# Altium project Elkapod_power_supply_controller_module.PrjPcb (part 5 of 5)
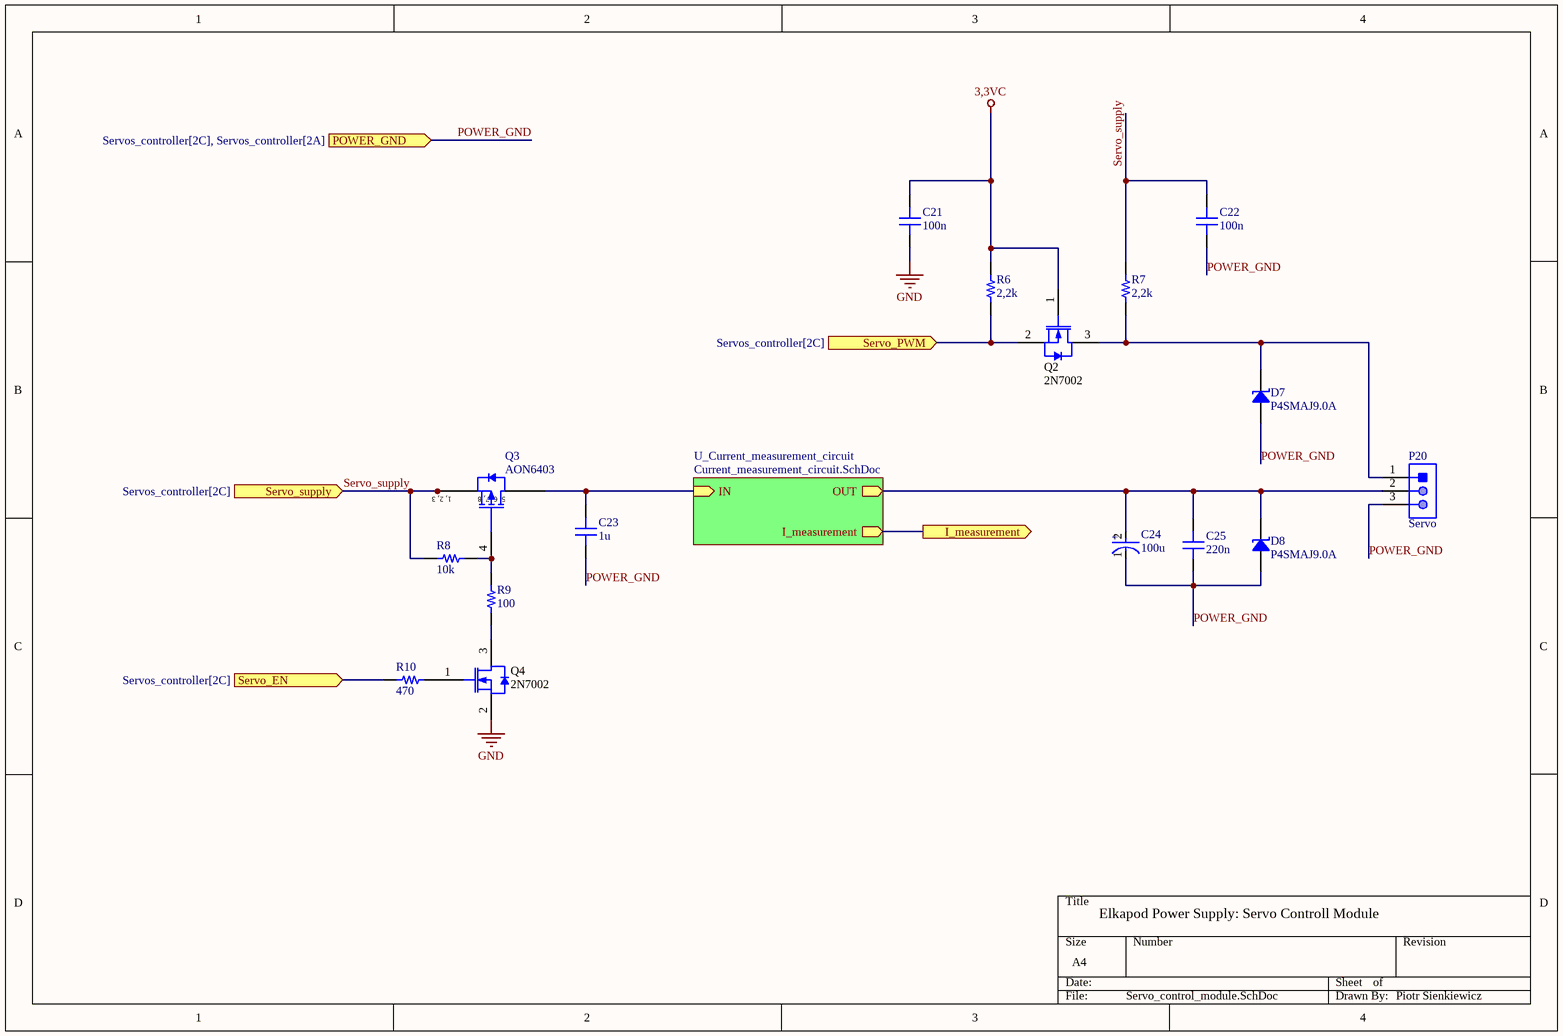
[diagram p9: Servo_control_module.SchDoc]

## Nets that join several sheets (continued)
SCK: Elkapod_power_supply_controller_module (CN1.20), Logic_controller (U3.111)
SCL: Elkapod_power_supply_controller_module (CN1.26), Logic_controller (R32.2 U3.11)
SDA: Elkapod_power_supply_controller_module (CN1.25), Logic_controller (R31.2 U3.10)
SERVO1_EN: Logic_controller (U3.69), U_Servos_controller/U_Servo_control_module (R10_U_Servos_controller_U_Servo_control_module#7.1)
SERVO2_EN: Logic_controller (U3.68), U_Servos_controller/U_Servo_control_module (R10_U_Servos_controller_U_Servo_control_module#8.1)
SERVO3_EN: Logic_controller (U3.67), U_Servos_controller/U_Servo_control_module (R10_U_Servos_controller_U_Servo_control_module#9.1)
SERVO4_EN: Logic_controller (U3.66), U_Servos_controller/U_Servo_control_module (R10_U_Servos_controller_U_Servo_control_module#10.1)
SERVO5_EN: Logic_controller (U3.65), U_Servos_controller/U_Servo_control_module (R10_U_Servos_controller_U_Servo_control_module#11.1)
SERVO6_EN: Logic_controller (U3.64), U_Servos_controller/U_Servo_control_module (R10_U_Servos_controller_U_Servo_control_module#12.1)
SERVO7_EN: Logic_controller (U3.63), U_Servos_controller/U_Servo_control_module (R10_U_Servos_controller_U_Servo_control_module#13.1)
SERVO8_EN: Logic_controller (U3.60), U_Servos_controller/U_Servo_control_module (R10_U_Servos_controller_U_Servo_control_module#14.1)
SERVO9_EN: Logic_controller (U3.59), U_Servos_controller/U_Servo_control_module (R10_U_Servos_controller_U_Servo_control_module#15.1)
SERVO10_EN: Logic_controller (U3.58), U_Servos_controller/U_Servo_control_module (R10_U_Servos_controller_U_Servo_control_module#16.1)
SERVO11_EN: Logic_controller (U3.57), U_Servos_controller/U_Servo_control_module (R10_U_Servos_controller_U_Servo_control_module#17.1)
SERVO12_EN: Logic_controller (U3.56), U_Servos_controller/U_Servo_control_module (R10_U_Servos_controller_U_Servo_control_module#18.1)
SERVO13_EN: Logic_controller (U3.55), U_Servos_controller/U_Servo_control_module (R10_U_Servos_controller_U_Servo_control_module#1.1)
SERVO14_EN: Logic_controller (U3.54), U_Servos_controller/U_Servo_control_module (R10_U_Servos_controller_U_Servo_control_module#2.1)
SERVO15_EN: Logic_controller (U3.53), U_Servos_controller/U_Servo_control_module (R10_U_Servos_controller_U_Servo_control_module#3.1)
SERVO16_EN: Logic_controller (U3.50), U_Servos_controller/U_Servo_control_module (R10_U_Servos_controller_U_Servo_control_module#4.1)
SERVO17_EN: Logic_controller (U3.49), U_Servos_controller/U_Servo_control_module (R10_U_Servos_controller_U_Servo_control_module#5.1)
SERVO18_EN: Logic_controller (U3.48), U_Servos_controller/U_Servo_control_module (R10_U_Servos_controller_U_Servo_control_module#6.1)
Servo_supply: Elkapod_power_supply_controller_module (P19.1), U_Servos_controller/U_Servo_control_module (6 pins), U_Servos_controller/U_Servo_control_module (6 pins), U_Servos_controller/U_Servo_control_module (6 pins), U_Servos_controller/U_Servo_control_module (6 pins), U_Servos_controller/U_Servo_control_module (6 pins), U_Servos_controller/U_Servo_control_module (6 pins)
Servo_supply: Elkapod_power_supply_controller_module (P16.1), U_Servos_controller/U_Servo_control_module (6 pins), U_Servos_controller/U_Servo_control_module (6 pins), U_Servos_controller/U_Servo_control_module (6 pins), U_Servos_controller/U_Servo_control_module (6 pins), U_Servos_controller/U_Servo_control_module (6 pins), U_Servos_controller/U_Servo_control_module (6 pins)
Servo_supply: Elkapod_power_supply_controller_module (P17.1), U_Servos_controller/U_Servo_control_module (6 pins), U_Servos_controller/U_Servo_control_module (6 pins), U_Servos_controller/U_Servo_control_module (6 pins), U_Servos_controller/U_Servo_control_module (6 pins), U_Servos_controller/U_Servo_control_module (6 pins), U_Servos_controller/U_Servo_control_module (6 pins)
U_TEMP1: Elkapod_power_supply_controller_module (CN1.9), Logic_controller (U7.1)
U_TEMP2: Elkapod_power_supply_controller_module (CN1.10), Logic_controller (U7.5)
U_TEMP3: Elkapod_power_supply_controller_module (CN1.11), Logic_controller (U7.2)
U_TEMP4: Elkapod_power_supply_controller_module (CN1.12), Logic_controller (U7.4)
V_OUT_EN1: Controllable_voltage_outputs (R68.2), Logic_controller (U3.139)
V_OUT_EN2: Controllable_voltage_outputs (R69.2), Logic_controller (U3.136)
V_OUT_EN3: Controllable_voltage_outputs (R70.2), Logic_controller (U3.135)
V_OUT_EN4: Controllable_voltage_outputs (R77.2), Logic_controller (U3.127)
V_OUT_EN5: Controllable_voltage_outputs (R78.2), Logic_controller (U3.126)
V_OUT_EN6: Controllable_voltage_outputs (R79.2), Logic_controller (U3.125)
VOLTAGE_EN: Elkapod_power_supply_controller_module (CN1.14 R3.2), Logic_controller (U3.12)